# EAGLE design Mono_rev1_GlowDriver (EAGLE 7.5.0)
Glow driver for 1 cyl with C, Amp, Volt, RPM, airspeed, bluetooth, display, logging
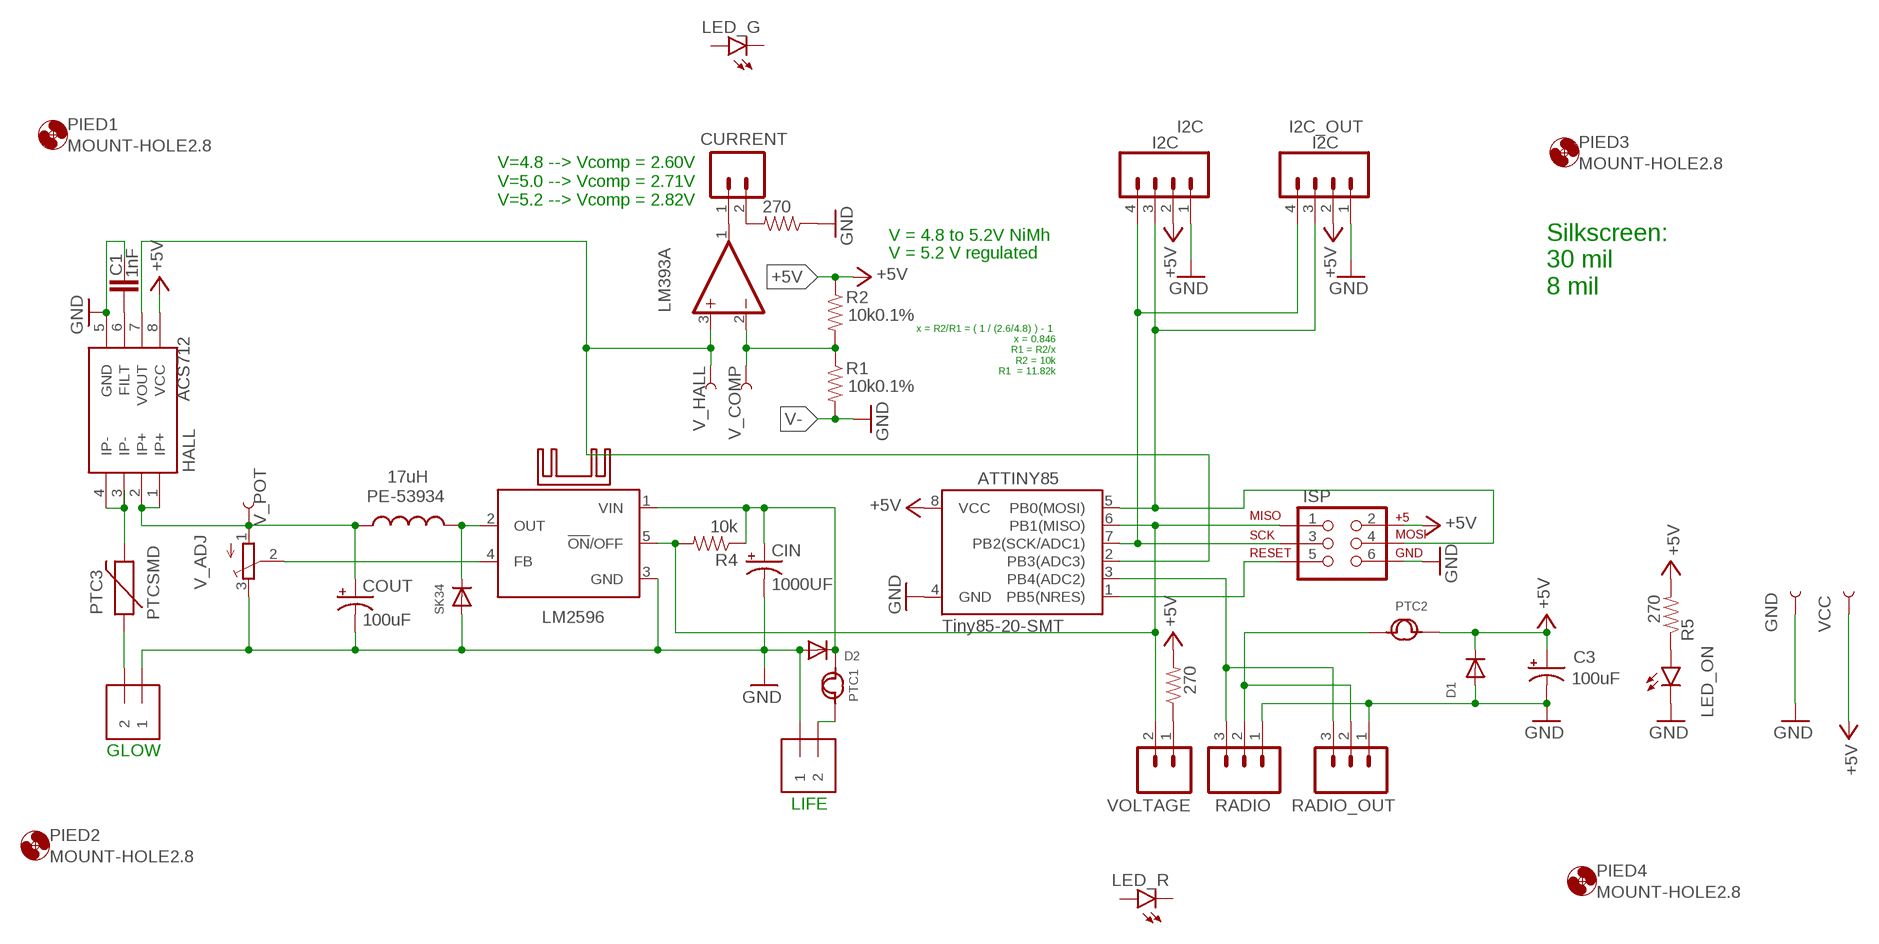
[diagram p0: schematic, sheet 1]

## Parts
ATTINY85  Tiny85-20-SMT  ATTINY45TINY85-20-SMT  [SO08-EIAJ]
C1  1nF  CAP0805  [0805]
C3  100uF  CPOL-USCT3216  [CT3216]
CIN  1000UF  CPOL-USG  [PANASONIC_G]
COUT  100uF  100UF-10V-10%(TANT)  [EIA7343]
CURRENT  M02PTH  [1X02]
D1  DIODESOD-123  [SOD-123]
D2  DIODESOD-123  [SOD-123]
GLOW  1X2-3.5MM  [1X2-3.5MM]
GND  TEST-POINTTP_15TH_THRU  [TP_15TH]
HALL  ACS712  [SO08]
I2C  I2C  M04PTH  [1X04]
I2C_OUT  I2C  M04PTH  [1X04]
ISP  AVR_SPI_PRG_6PTH  [2X3]
KK1  D0A-L  [D02A-L]
LED_G  LED5MM  [LED5MM]
LED_ON  LED-GREEN1206  [LED-1206]
LED_R  LED5MM  [LED5MM]
LIFE  1X2-3.5MM  [1X2-3.5MM]
LM393  LM393D  [SO08]
LM2596  LM2596S  [TO263-5]
PE-53934  17uH  PE-53934  [LCI-44]
PIED1  MOUNT-HOLE2.8  [2,8]
PIED2  MOUNT-HOLE2.8  [2,8]
PIED3  MOUNT-HOLE2.8  [2,8]
PIED4  MOUNT-HOLE2.8  [2,8]
PTC1  750MA-6V  SMD-PPTC-750MA-6V(1210)  [F1210]
PTC2  100A-6V  SMD PPTC 100A-6V(0805)  [F0805]
PTC3  PTCSMD  [PTC-1206]
R1  10k0.1%  RESISTOR0805-RES  [0805]
R2  10k0.1%  RESISTOR0805-RES  [0805]
R3  270  RESISTOR0805-RES  [0805]
R4  10k  RESISTOR0805-RES  [0805]
R5  270  RESISTOR0805-RES  [0805]
R6  270  RESISTOR0805-RES  [0805]
RADIO  M03PTH  [1X03]
RADIO_OUT  M03PTH  [1X03]
SK34  DIODESMA  [SMADIODE]
V_ADJ  TRIMPOTTC33X  [TC33X]
V_COMP  TEST-POINTTP_15TH_THRU  [TP_15TH]
V_HALL  TEST-POINTTP_15TH_THRU  [TP_15TH]
V_POT  TEST-POINTTP_15TH_THRU  [TP_15TH]
VCC  TEST-POINTTP_15TH_THRU  [TP_15TH]
VOLTAGE  M02PTH  [1X02]

## Nets
+5V: ATTINY85.8(VCC) C3.+ D1.C HALL.8(VCC) I2C.2 I2C_OUT.2 ISP.2 PTC2.2 R2.1 R3.2 R5.2 VCC.P$1
GND: ATTINY85.4(GND) C1.1 C3.- CIN.- COUT.C(-) D1.A D2.A GLOW.1 GND.P$1 HALL.5(GND) I2C.1 I2C_OUT.1 ISP.6 LED_ON.C LIFE.1 LM2596.3(GND) R6.1 RADIO.1 RADIO_OUT.1 SK34.A V_ADJ.3(E)
N$1: R3.1 VOLTAGE.1
N$2: ATTINY85.3(PB4(ADC2)) RADIO.3 RADIO_OUT.3
N$3: ATTINY85.7(PB2(SCK/ADC1)) I2C.4 I2C_OUT.4 ISP.3
N$4: ATTINY85.2(PB3(ADC3)) HALL.7(VOUT) LM393.3(A:+IN) V_HALL.P$1
N$5: LED_ON.A R5.1
N$6: HALL.3(IP-) HALL.4(IP-) PTC3.2
N$7: CURRENT.2 R6.2
N$8: CURRENT.1 LM393.1(A:OUT)
N$9: LM2596.2(OUT) PE-53934.P$2 SK34.C
N$10: GLOW.2 PTC3.1
N$11: LIFE.2 PTC1.1
N$12: LM2596.4(FB) V_ADJ.2(S)
N$13: CIN.+ D2.C LM2596.1(VIN) PTC1.2 R4.1
N$14: PTC2.1 RADIO.2 RADIO_OUT.2
N$15: LM393.2(A:-IN) R1.1 R2.2 V_COMP.P$1
N$33: ATTINY85.5(PB0(MOSI)) I2C.3 I2C_OUT.3 ISP.4
N$36: ATTINY85.6(PB1(MISO)) ISP.1 LM2596.5(!ON!/OFF) R4.2 VOLTAGE.2
N$55: C1.2 HALL.6(FILT)
N$110: ATTINY85.1(PB5(NRES)) ISP.5
POT10K: COUT.A(+) HALL.1(IP+) HALL.2(IP+) PE-53934.P$1 V_ADJ.1(A) V_POT.P$1
V-: R1.2 ; supply symbol labelled GND
Unconnected: LED_G.A LED_G.K(C) LED_R.A LED_R.K(C) LM393.5(B:+IN) LM393.6(B:-IN) LM393.7(B:OUT)

## Notes on the sheet
- V=4.8 --> Vcomp = 2.60V
  V=5.0 --> Vcomp = 2.71V
  V=5.2 --> Vcomp = 2.82V
- V = 4.8 to 5.2V NiMh
- V = 5.2 V regulated
- Silkscreen:
  30 mil
  8 mil
- x = R2/R1 = ( 1 / (2.6/4.8) ) - 1 
  x = 0.846
  R1 = R2/x
  R2 = 10k
  R1  = 11.82k
- GLOW
- LIFE

## Power pins joined to a net without a drawn wire
+5V: LM393.8(P:V+)
V-: LM393.4(P:V-)

## Library data of the parts
ATTINY85 = SparkFun-DigitalIC:ATTINY45: Atmel 8-pin 2/4/8kB flash uC; DIGIKEY: ATTINY85-20SU-ND; PROD_ID: IC-09092
C1 = SparkFun-Capacitors:CAP: Capacitor Standard 0603 ceramic capacitor, and 0.1" leaded capacitor.; DIGIKEY: 490-11585-1-ND
C3 = adafruit:CPOL-US: POLARIZED CAPACITOR, American symbol; DIGIKEY: 478-1777-1-ND
CIN = adafruit:CPOL-US: POLARIZED CAPACITOR, American symbol; DIGIKEY: 493-3930-1-ND
COUT = SparkFun-Capacitors:100UF-10V-10%(TANT): CAP-07890; DIGIKEY: 478-9193-1-ND; PROD_ID: CAP-07890
CURRENT VOLTAGE = SparkFun-Connectors:M02: Standard 2-pin 0.1" header. Use with - straight break away headers ( PRT-00116) - right angle break away headers (PRT-00553) - swiss pins (PRT-00743) - machine pins (PRT-00117) - female headers (PRT-00115) Molex polarized connector foot print use with: PRT-08233 with associated crimp pins and housings. 2.54_SCREWTERM for use with PRT-10571. 3.5mm Screw Terminal footprints for PRT-08084 5mm Screw Terminal footprints for use with PRT-08432; DIGIKEY: S1011EC-40-ND
D1 D2 = adafruit:DIODE: Diode SMADIODE - SMA Surface Mount Package 20V 1A Schottky Diode Digikey: 641-1014-6-ND DO-1N4148 - Through Hole Small Current Diode SOD-123 20V 1 A (.5mV Vf) Schottky Diode - Digikey: MBRX120TPMSCT-ND SOD-323 10V 570mA (.38mV Vf, 3ns) Schottky Diode - Digikey: ZLLS410CT-ND SOD-523 30V 30mA Schottky Diode (RB751S-40TE61) - Digikey: RB751S-40TE61CT-ND SOT23-R/W - SOT23 Package (R = Solder Paste/Reflow Ovens, W = Hand-Soldering) BAT54Film 40V 300mA - Digikey: 497-7162-1-ND; DIGIKEY: 1N4150W-E3-08CT-ND
GLOW LIFE = adafruit:1X2: 3.5mm Terminal block http://www.ladyada.net/library/pcb/eaglelibrary.html; DIGIKEY: ED1514-ND
GND V_COMP V_HALL V_POT VCC = SparkFun-Passives:TEST-POINT: Bare copper test points for troubleshooting or ICT
HALL = SparkFun-AnalogIC:ACS712: Hall-effect-based isolated linear current sensor; DIGIKEY: 620-1189-1-ND; PROD_ID: IC-08964
I2C I2C_OUT = SparkFun-Connectors:M04: Header 4 Standard 4-pin 0.1" header. Use with straight break away headers (SKU : PRT-00116), right angle break away headers (PRT-00553), swiss pins (PRT-00743), machine pins (PRT-00117), and female headers (PRT-00115). Molex polarized connector foot print use with SKU : PRT-08231 with associated crimp pins and housings. 1MM SMD Version SKU: PRT-10208; DIGIKEY: S1011EC-40-ND
ISP = SparkFun-Connectors:AVR_SPI_PRG_6: AVR ISP 6 Pin This is the reduced ISP connector for AVR programming. Common on Arduino. This footprint will take up less PCB space and can be used with a 10-pin to 6-pin adapter such as SKU: BOB-08508 **Special note about "TEST_POINT" package. The stop mask is on the top side, so if you want your programming test points to be on the bottom of your board, make sure to place this package on the bottom side of the board. This also ensure that the orientation to program from the bottom side will be correct.; DIGIKEY: 609-2423-ND
KK1 = heatsink:D0A-L: HEATSINK distributor Schukat; DIGIKEY: AE10837-ND
LED_G LED_R = SparkFun-LED:LED: LEDs Standard schematic elements and footprints for 5mm, 3mm, 1206, and 0603 sized LEDs. 5mm - Spark Fun Electronics SKU : COM-00529 (and others)
LED_ON = SparkFun-LED:LED-GREEN: Various green LEDs Green LEDs used in SFE Production 0603- DIO-00821 LARGE- DIO-00862 LILYPAD- DIO-09910; DIGIKEY: 404-1046-1-ND; PROD_ID: DIO-00862; VALUE: GREEN
LM393 = linear:LM393: COMPARATOR; DIGIKEY: 296-1015-5-ND
LM2596 = national-semiconductor:LM2596: SIMPLE SWITCHER® Power Converter 150 kHz 3A Step-Down Voltage Regulator Source: http://www.national.com/ds/LM/LM2596.pdf; DIGIKEY: 296-35399-1-ND; MF: NATIONAL SEMICONDUCTOR; MPN: LM2596S-ADJ/NOPB; OC_FARNELL: 9494367; OC_NEWARK: 41K3842
PE-53934 = juju:PE-53934; DIGIKEY: 553-1417-ND
PIED1-PIED4 = holes:MOUNT-HOLE: MOUNTING HOLE with drill center marker
PTC1 = Seeed-OPL-fuse:SMD-PPTC-750MA-6V(1210): 307010010; DIGIKEY: F5766CT-ND; MPN: SMD1210R075SF
PTC2 = Seeed-OPL-fuse:SMD PPTC 100A-6V(0805): 307010046; DIGIKEY: 507-1811-1-ND; MPN: SMD0805R100S
PTC3 = SparkFun-PowerIC:PTC: Resettable Fuse PTC Resettable Fuse. Spark Fun Electronics SKU : COM-08357; DIGIKEY: RF2305-000CT-ND; PROD_ID: RES-11150
R1 R2 R4 = SparkFun-Resistors:RESISTOR: Resistor Basic schematic elements and footprints for 0603, 1206, and PTH resistors.; DIGIKEY: P10KACT-ND
R3 R6 = SparkFun-Resistors:RESISTOR: Resistor Basic schematic elements and footprints for 0603, 1206, and PTH resistors.; DIGIKEY: P270ACT-ND
R5 = SparkFun-Passives:RESISTOR: Resistor Basic schematic elements and footprints for 0603, 1206, and PTH resistors.; DIGIKEY: P270ACT-ND
RADIO RADIO_OUT = SparkFun-Connectors:M03: Header 3 Standard 3-pin 0.1" header. Use with straight break away headers (SKU : PRT-00116), right angle break away headers (PRT-00553), swiss pins (PRT-00743), machine pins (PRT-00117), and female headers (PRT-00115). Molex polarized connector foot print use with SKU : PRT-08232 with associated crimp pins and housings.; DIGIKEY: S1011EC-40-ND
SK34 = adafruit:DIODE: Diode SMADIODE - SMA Surface Mount Package 20V 1A Schottky Diode Digikey: 641-1014-6-ND DO-1N4148 - Through Hole Small Current Diode SOD-123 20V 1 A (.5mV Vf) Schottky Diode - Digikey: MBRX120TPMSCT-ND SOD-323 10V 570mA (.38mV Vf, 3ns) Schottky Diode - Digikey: ZLLS410CT-ND SOD-523 30V 30mA Schottky Diode (RB751S-40TE61) - Digikey: RB751S-40TE61CT-ND SOT23-R/W - SOT23 Package (R = Solder Paste/Reflow Ovens, W = Hand-Soldering) BAT54Film 40V 300mA - Digikey: 497-7162-1-ND; DIGIKEY: SK34A-TPCT-ND
V_ADJ = adafruit:TRIMPOT: SMT trimmer potentiometer part number TC33X http://www.ladyada.net/library/eagle; DIGIKEY: TC33X-103ECT-ND

## Net classes
0 default: width 0.254 mm, drill 0.61 mm, clearance 0.254 mm

## Board
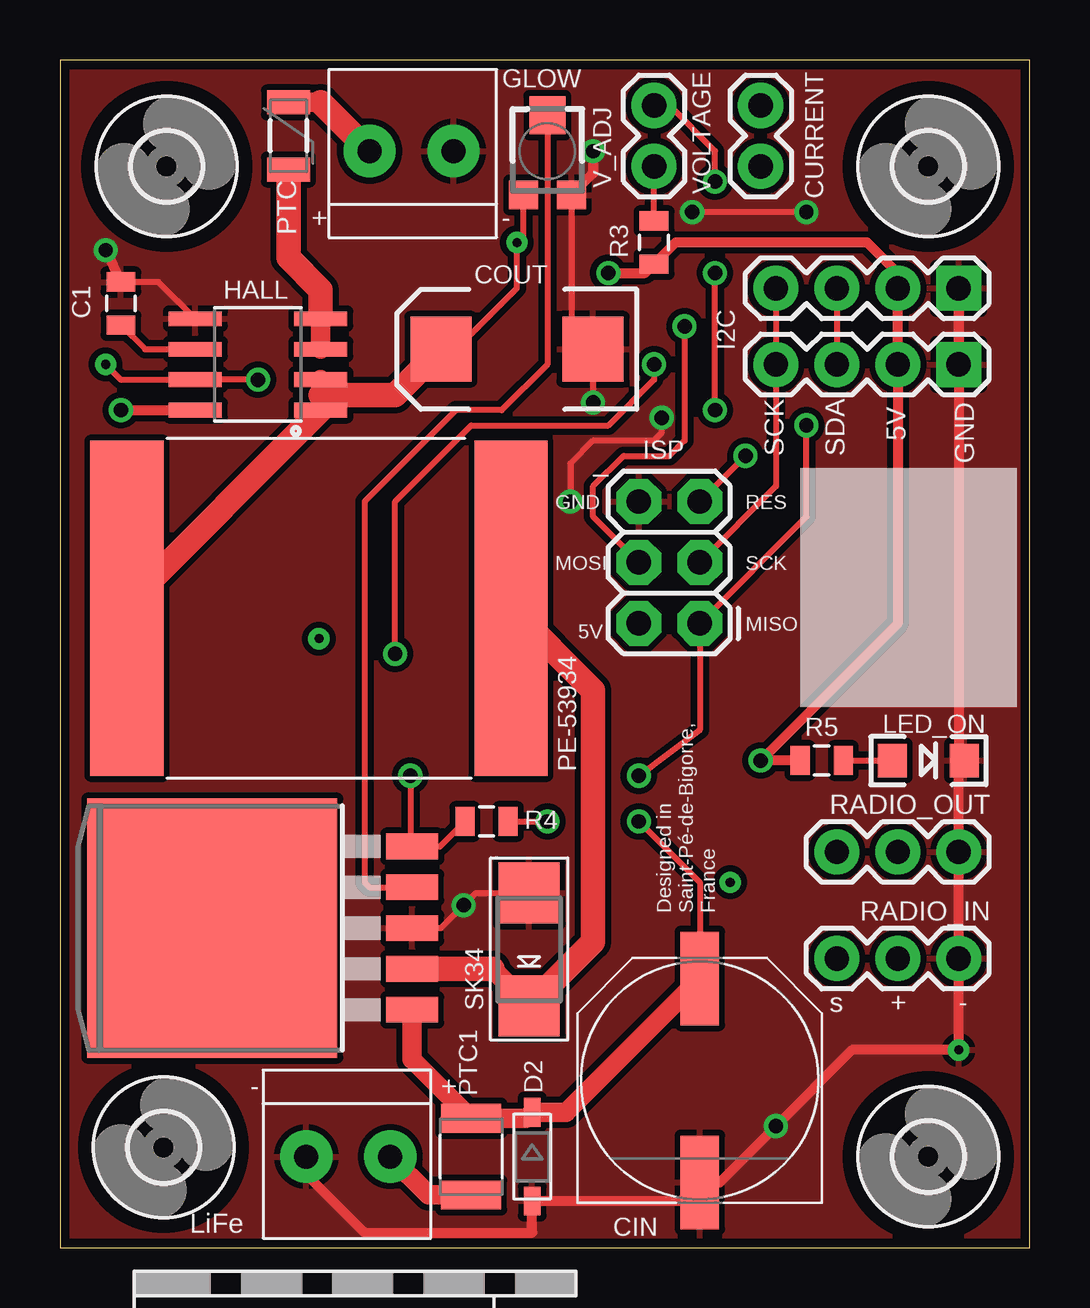
[diagram p1: board, top side]
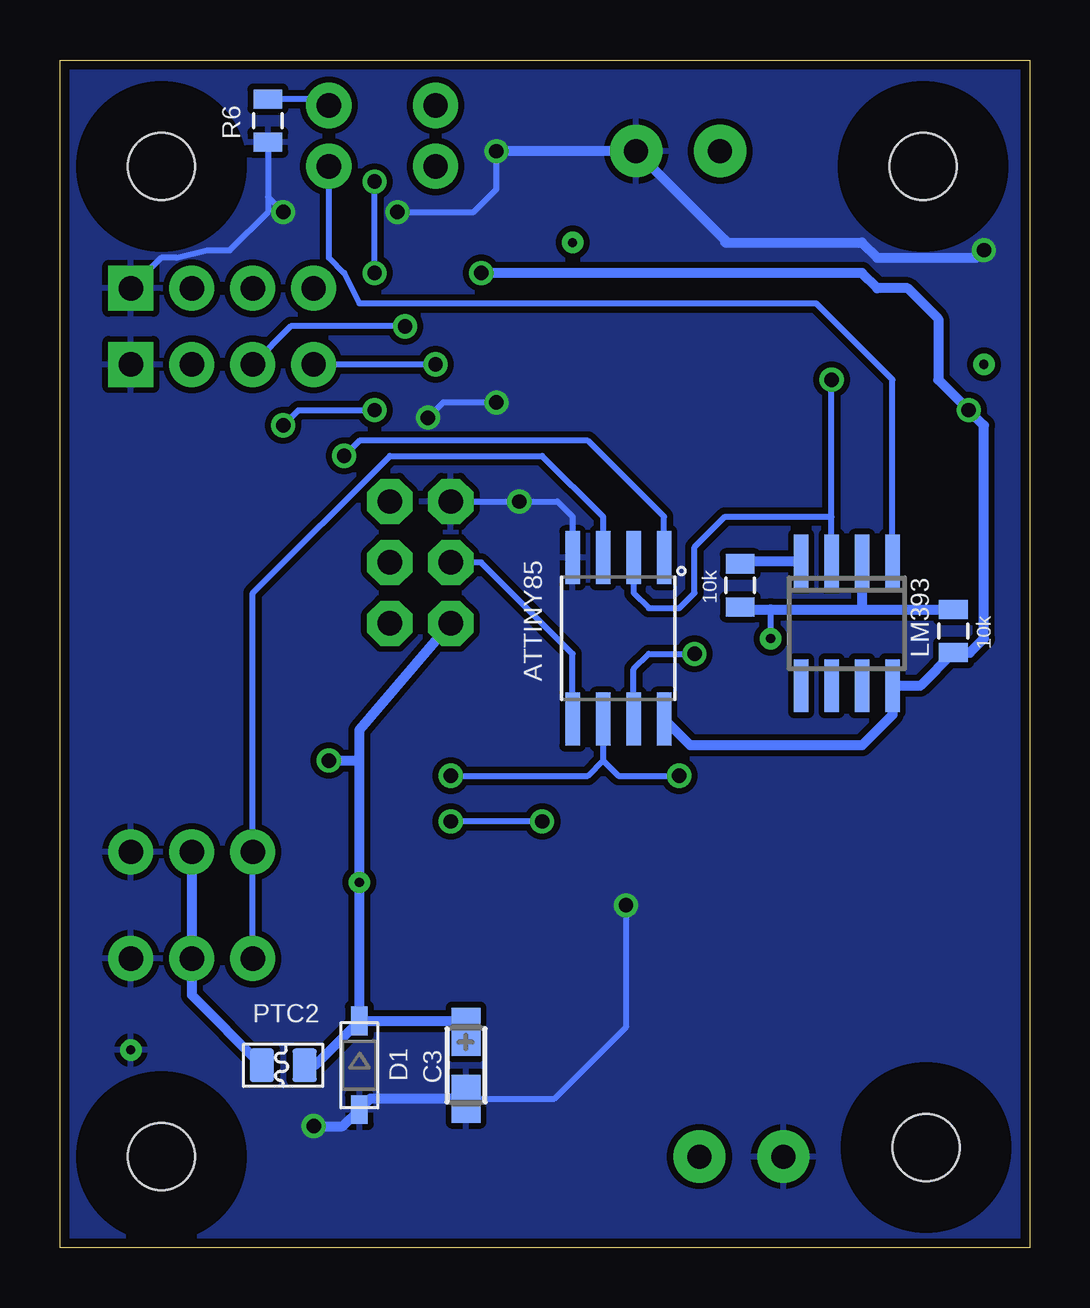
[diagram p2: board, bottom side, seen from below]

Size 40.42 x 49.52 mm. Coordinates in mm from the lower left corner, seen from the top.
Outline: 0,0 40.42,0 40.42,49.52 0,49.52 0,0
Copper layers (1*16): Top 0.035mm / dielectric 1.6mm / Bottom 0.035mm
Design rules "default *": minimum track width 10mil, minimum drill 15mil, track to track 10mil, track to pad 10mil, pad to pad 10mil, via to via 10mil, smd to smd 10mil, copper to edge 15mil, drill to drill 20mil, minimum pad ring 10mil, minimum via ring 8mil, stop-mask expansion 4mil, vias tented up to drill 0mil, thermal gap 10mil

### Footprints (pad centres in the part's own frame; a part is rotated, then mirrored left to right if it is on the bottom)
SO08-EIAJ = smd 0.61 x 2.21: 1 -1.905,-3.378; 2 -0.635,-3.378; 3 0.635,-3.378; 4 1.905,-3.378; 5 1.905,3.353; 6 0.635,3.353; 7 -0.635,3.353; 8 -1.905,3.353
0805 = smd 0.8 x 1.2: 1 -0.9,0; 2 0.9,0
CT3216 = smd 2 x 1.2: + 1.4,0; - -1.4,0
PANASONIC_G = smd 3.9 x 1.6: + 4.25,0; - -4.25,0
EIA7343 = smd 2.55 x 2.7: A 3.17,0; C -3.17,0
1X02 = drill 1.016 pad 1.88: 1 0,0; 2 2.54,0
SOD-123 = smd 1.2 x 0.7: A 1.85,0; C -1.85,0
1X2-3.5MM = drill 1 pad 2.184: 1 1.8,0; 2 -1.7,0
TP_15TH = drill 0.381 pad 0.61: P$1 0,0
SO08 = smd 0.61 x 2.21: 1 -1.905,-2.616; 2 -0.635,-2.616; 3 0.635,-2.616; 4 1.905,-2.616; 5 1.905,2.616; 6 0.635,2.616; 7 -0.635,2.616; 8 -1.905,2.616
1X04 = drill 1.016 pad 1.88 square: 1 0,0 | drill 1.016 pad 1.88: 2 2.54,0; 3 5.08,0; 4 7.62,0
2X3 = drill 1.016 pad 1.88 octagon: 1 0,0; 2 0,2.54; 3 2.54,0; 4 2.54,2.54; 5 5.08,0; 6 5.08,2.54
LED5MM = drill 0.813 pad 1.88: A -1.27,0; K 1.27,0
LED-1206 = smd 1.2 x 1.4: A -1.5,0; C 1.5,0
SO08' = smd 0.6 x 2.2: 1 -1.905,-2.6; 2 -0.635,-2.6; 3 0.635,-2.6; 4 1.905,-2.6; 5 1.905,2.6; 6 0.635,2.6; 7 -0.635,2.6; 8 -1.905,2.6
TO263-5 = smd 1.067 x 2.159: 1 -3.404,-5.791; 2 -1.702,-5.791; 3 0,-5.791; 4 1.702,-5.791; 5 3.404,-5.791 | smd 10.8 x 10.41: 6 0,2.54
LCI-44 = smd 3.048 x 13.97: P$1 -8.001,0; P$2 8.001,0
2,8 = hole 2.8: 0,0
F1210 = smd 1.2 x 2.5: 1 -1.6,0; 2 1.6,0
F0805 = smd 1.397 x 1.016: 1 0,0.889; 2 0,-0.889
PTC-1206 = smd 1 x 1.8: 1 -1.4,0; 2 1.4,0
1X03 = drill 1.016 pad 1.88: 1 0,0; 2 2.54,0; 3 5.08,0
SMADIODE = smd 2.54 x 2.54: A 2.349,0; C -2.349,0
TC33X = smd 1.2 x 1.2: 1 -1,-1.825; 3 1,-1.825 | smd 1.5 x 1.6: 2 0,1.5

### Placement (x,y rotation side)
ATTINY85  17.14,25.4 180 bottom
C1  2.54,39.37 270 top
C3  23.5,7.62 90 bottom
CIN  26.67,6.99 90 top
COUT  19.05,37.47 180 top
CURRENT  29.21,45.09 90 top
D1  27.94,7.62 270 bottom
D2  19.68,3.81 270 top
GLOW  14.61,45.72 0 top
GND  37.47,8.26 0 top
HALL  8.26,36.83 90 top
I2C  37.47,36.83 180 top
I2C_OUT  37.47,40.01 180 top
ISP  26.67,26.04 90 top
KK1  14.61,-7.62 0 top  (outside the outline)
LED_G  3.17,-18.41 0 top  (outside the outline)
LED_ON  36.2,20.32 0 top
LED_R  3.17,-25.4 0 top  (outside the outline)
LIFE  12.06,3.81 180 top
LM393  LM393D  [SO08']  7.62,26.04 180 bottom
LM2596  8.89,13.34 90 top
PE-53934  10.79,26.67 0 top
PIED1  36.2,45.09 0 top
PIED2  36.2,3.81 0 top
PIED3  4.45,45.09 0 top
PIED4  4.32,4.19 0 top
PTC1  17.14,3.81 90 top
PTC2  31.11,7.62 90 bottom
PTC3  9.53,46.35 270 top
R1  12.06,27.62 90 bottom
R2  3.17,25.72 90 bottom
R3  24.77,41.91 270 top
R4  17.78,17.78 180 top
R5  31.75,20.32 180 top
R6  31.75,46.99 90 bottom
RADIO  37.47,12.06 180 top
RADIO_OUT  37.47,16.51 180 top
SK34  19.56,12.45 90 top
V_ADJ  20.32,45.72 0 top
V_COMP  10.79,25.4 0 top
V_HALL  1.91,36.83 0 top
V_POT  19.05,41.91 0 top
VCC  27.94,15.24 90 top
VOLTAGE  24.77,45.09 90 top

### Tracks (layer width: path | path; a pad name or v marks a point on that pad's centre or on a via)
+5V  (via drill 0.6)
  Top 0.406: R5.2 v29.21,20.32 34.92,26.04 I2C.2 I2C_OUT.2 34.92,40.64 33.66,41.91 25.66,41.91 R3.2 24.39,40.64 v22.86,40.64 | v2.54,34.92 HALL.8
  Bottom 0.406: PTC2.2 29.79,7.62 D1.C | D1.C 23.95,9.47 C3.+ | D1.C VCC.P$1 27.94,20.32 | 27.94,20.32 27.94,21.59 ISP.2 | v29.21,20.32 27.94,20.32 | ATTINY85.8 14.15,20.95 6.99,20.95 5.71,22.23 LM393.8 4.56,23.43 R2.1 2.49,24.82 1.91,25.4 1.91,34.29 v2.54,34.92 3.81,36.2 3.81,38.73 5.08,40.01 6.35,40.01 6.99,40.64 v22.86,40.64
GND  (via drill 0.6)
  Top 0.254: HALL.5 4.1,40.27 C1.1 | V_ADJ.3 21.32,38.37 COUT.C 22.22,35.55 v22.23,35.24 | v25.08,34.61 25.08,33.97 24.77,33.66 22.23,33.66 21.27,32.7 v21.27,31.11 | v31.11,43.18 v26.35,43.18 | LM2596.3 15.88,13.34 v16.83,14.29 17.34,14.8 SK34.A
  Top 0.406: LIFE.1 10.27,3.07 12.7,0.64 19.68,0.64 D2.A 25.89,1.96 CIN.- 27.5,2.73 v29.84,5.08 33.02,8.26 GND.P$1 RADIO.1 RADIO_OUT.1 37.47,20.09 LED_ON.C 37.47,20.55 I2C_OUT.1 I2C.1 | v22.23,45.72 22.23,44.8 V_ADJ.3 | v1.91,41.59 C1.1
  Bottom 0.254: ISP.6 v21.27,31.11 19.68,31.11 19.05,30.48 ATTINY85.4 | v22.23,35.24 24.45,35.24 v25.08,34.61 | R6.1 31.75,43.81 | 31.75,43.81 v31.11,43.18 | v26.35,43.18 23.18,43.18 22.23,44.13 v22.23,45.72 | 31.75,43.81 31.75,43.18 33.34,41.59 34.29,41.59 35.56,41.27 36.2,41.27 I2C_OUT.1 | C3.- 19.82,6.22 16.83,9.21 v16.83,14.29
  Bottom 0.406: C3.- 27.49,6.22 D1.A 28.63,5.08 v29.84,5.08 | v22.23,45.72 GLOW.1 12.7,42.02 12.7,41.91 6.99,41.91 6.35,41.27 2.22,41.27 v1.91,41.59
  pour Bottom: 0,0 0,49.53 40.64,49.53 40.64,0
  pour Top: 0,0 0,49.53 40.64,49.53 40.64,0
N$1
  Top 0.254: R3.1 VOLTAGE.1
N$2
  Bottom 0.254: RADIO.3 RADIO_OUT.3 32.38,27.3 26.67,33.02 20.32,33.02 17.78,30.48 ATTINY85.3
N$3  (via drill 0.6)
  Top 0.254: I2C_OUT.4 I2C.4 29.84,31.75 ISP.3 | v13.97,24.77 13.97,31.11 17.14,34.29 22.86,34.29 24.77,36.2 v24.77,36.83
  Bottom 0.254: ATTINY85.7 16.51,24.13 15.88,24.77 v13.97,24.77 | v24.77,36.83 I2C.4
N$4  (via drill 0.6)
  Top 0.254: V_HALL.P$1 2.54,36.2 HALL.7 v8.26,36.2
  Bottom 0.254: LM393.3 8.26,30.48 | 8.26,30.48 v8.26,36.2 | ATTINY85.2 16.51,27.3 15.88,26.67 14.61,26.67 13.97,27.3 13.97,29.21 12.7,30.48 8.26,30.48
N$5
  Top 0.254: R5.1 LED_ON.A
N$6
  Top 0.813: HALL.3 HALL.4
  Top 1.016: HALL.4 10.87,39.93 9.53,41.27 PTC3.2
N$7
  Bottom 0.254: CURRENT.2 29.48,47.89 R6.2
N$8
  Bottom 0.254: LM393.1 5.71,36.2 8.89,39.37 27.94,39.37 28.57,40.64 29.21,41.27 CURRENT.1
N$9
  Top 0.813: 18.02,11.63 SK34.C
  Top 1.016: LM2596.2 18.02,11.63 | SK34.C 22.23,12.76 22.23,23.24 PE-53934.P$2
N$10
  Top 0.813: PTC3.1 10.87,47.76
  Top 1.016: 10.87,47.76 GLOW.2
N$11
  Top 0.813: LIFE.2 15.37,2.21 PTC1.1
N$12
  Top 0.254: V_ADJ.2 20.32,36.83 18.41,34.92 16.51,34.92 12.7,31.11 12.7,15.24 12.9,15.04 LM2596.4
N$13  (via drill 0.6)
  Top 0.254: R4.1 v20.32,17.78 | v24.13,17.78 26.67,15.24 CIN.+
  Top 0.61: 19.43,5.41 D2.C
  Top 0.813: LM2596.1 14.68,7.87 PTC1.2 19.43,5.41 | D2.C 21.09,5.66 CIN.+
  Bottom 0.254: v20.32,17.78 v24.13,17.78
N$14
  Bottom 0.406: RADIO_OUT.2 RADIO.2 34.92,10.54 PTC2.1
N$15
  Bottom 0.254: V_COMP.P$1 10.79,26.62
  Bottom 0.406: R1.1 11.96,26.62 10.79,26.62 6.99,26.62 | 6.99,26.62 R2.2 | LM393.2 6.99,26.62
N$33  (via drill 0.6)
  Top 0.254: I2C_OUT.3 I2C.3 | ISP.4 22.23,30.48 22.23,31.75 23.5,33.02 25.4,33.02 26.04,33.66 v26.04,38.42
  Bottom 0.254: v26.04,38.42 30.8,38.42 I2C.3 | ATTINY85.5 19.05,24.77 22.86,28.57 ISP.4
N$36  (via drill 0.6)
  Top 0.254: R4.2 15.84,16.74 LM2596.5 14.61,16.82 v14.61,19.68 | v24.13,19.68 26.67,21.59 ISP.1 31.11,30.48 v31.11,34.29 | v27.3,44.45 27.3,45.72 25.4,47.62 VOLTAGE.2 | v27.3,34.92 v27.3,40.64
  Bottom 0.254: ATTINY85.6 17.78,20.32 | 17.78,20.32 17.14,19.68 v14.61,19.68 | v24.13,19.68 18.41,19.68 17.78,20.32 | v31.11,34.29 30.48,34.92 v27.3,34.92 | v27.3,40.64 v27.3,44.45
N$55
  Top 0.254: C1.2 3.54,37.47 HALL.6
N$110  (via drill 0.6)
  Top 0.254: v28.57,33.02 ISP.5
  Bottom 0.254: ATTINY85.1 15.24,30.48 18.41,33.66 27.94,33.66 v28.57,33.02
POT10K
  Top 0.254: V_ADJ.1 19.32,42.18 V_POT.P$1 19.05,40 16.52,37.47 COUT.A
  Top 0.813: HALL.2 10.87,35.56 HALL.1 | 2.79,26.85 PE-53934.P$1
  Top 1.016: HALL.1 2.79,26.85 | COUT.A 13.97,35.56 10.87,35.56
V-
  Bottom 0.406: R1.2 11.95,28.64 LM393.4

### Text on the board
tPlace: + | - | PTC | 5V | SCK | SDA | GND | _ | GND | RES | MOSI | SCK | MISO | 5V | RADIO_OUT | Designed in / Saint-Pé-de-Bigorre, / France | RADIO_IN | s | + | - | - | + | LiFe
bPlace: 10k | 10k